# Altium schematic sheet N17V5 Reference.SchDoc
size A4
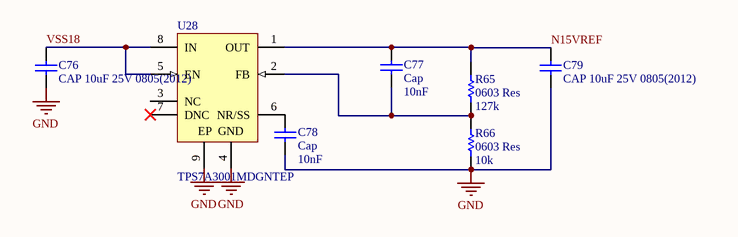
[diagram p0: N17V5 Reference.SchDoc]

## Parts
C76  CAP 10uF 25V 0805(2012)  [CAPC0805(2012)145_N]
C77  Cap  value 10nF  [1608[0603]]
C78  Cap  value 10nF  [1608[0603]]
C79  CAP 10uF 25V 0805(2012)  [CAPC0805(2012)145_N]
R65  0603 Res  value 127k  [J1-0603]
R66  0603 Res  value 10k  [J1-0603]
U28  TPS7A3001MDGNTEP  [DGN0008D_M]

## Nets
GND: C76.1 C78.1 C79.1 R66.2 U28.4(GND) U28.9(EP)
N15VREF: C77.2 C79.2 R65.1 U28.1(OUT)
VSS18: C76.2 U28.5(EN) U28.8(IN)
NetC77_1: C77.1 R65.2 R66.1 U28.2(FB)
NetC78_2: C78.2 U28.6(NR/SS)

Not connected (* = marked no-connect by the designer): U28 3(NC) 7(DNC)*

## Library data of the parts
C76 C79 = CMP-1036-04932-1: CAP 10uF 25V ±10% 0805 (2012 Metric) Thickness 1.45mm SMD; Case-EIA: 0805; Case-Metric: 2012; Tolerance: Â±10%; Technology: SMT; Value: 10uF; Rated Voltage: 25 V; Max Thickness: 1.45 mm
C77 C78 = Cap: Capacitor; Published: 8-Jun-2000; LatestRevisionDate: 17-Jul-2002; LatestRevisionNote: Re-released for DXP Platform.; PackageReference: RAD-0.3; Publisher: Altium Limited; PackageDescription: Radial Cap, Thru-Hole; 2 Leads; 0.3 in Pin Spacing
R65 R66 = Res1: Chip Resistor, 0603, 1%; Published: 8-Jun-2000; LatestRevisionDate: 17-Jul-2002; LatestRevisionNote: Re-released for DXP Platform.; PackageReference: AXIAL-0.3; Publisher: Altium Limited; PackageDescription: Axial Device, Thru-Hole; 2 Leads; 0.3 in Pin Spacing
U28 = CMP-0394-01251-2: Single Output High PSRR LDO, 200 mA, Adjustable -1.18 to -33 V Output, -3 to -36 V Input, with Ultra-Low Noise, 8-pin MSOP (DGN), -55 to 125 degC, Green (RoHS & no Sb/Br); Manufacturer: Texas Instruments; Vdo(Typ)(mV): 216; Iq(Typ)(mA): 0.05; Accuracy(%): 1.5; SubFamily: Single Channel LDO; Iout(Max)(A): 0.2; Vin(Min)(V): -3; PackageDescription: 8-pin Plastic Small Outline, Body 3 x 3 mm, Pitch 0.65 mm; ComponentLink3URL: http://www.ti.com/litv/pdf/mpds046e; ComponentLink1URL: http://www.ti.com/; ComponentLink2Description: Datasheet; ComponentLink2URL: http://www.ti.com/general/docs/lit/getliterature.tsp?genericPartNumber=TPS7A3001-EP&fileType=pdf; Code_JEDEC: MO-187; ComponentLink1Description: Manufacturer URL; Vout Adj(Max)(V): -33; Eco-Plan: Green (RoHS & no Sb/Br); DatasheetVersion: SBVS174; ComponentLink3Description: Package Specification; Vin(Max)(V): -36; PartNumber: TPS7A3001MDGNTEP; PackageReference: DGN0008D; Vout Adj(Min)(V): -1.18; PackageVersion: 4073271/F; Mounting Technology: Surface Mount